# Altium schematic sheet Gyroscope.SchDoc
size A; SheetNumber: 3; SheetTotal: 6
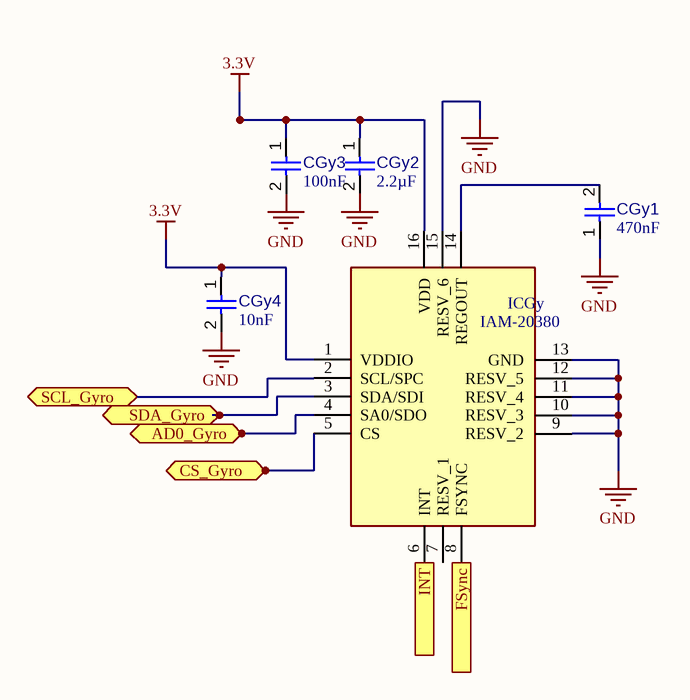
[diagram p0: Gyroscope.SchDoc]

## Parts
CGy1  value 470nF  [CAPC0402(1005)60_L]  (hidden comment: Capacitor 470nF +/-40% 10V 0402)
CGy2  value 2.2µF  [CAPC0402(1005)60_L]  (hidden comment: Capacitor 2,2µF +/-20% 10V 0402)
CGy3  value 100nF  [CAPC1005X56X25LL10T15]  (hidden comment: Capacitor 0.1 uF +/- 5% 16 V 0402)
CGy4  value 10nF  [CAPC0402(1005)60_L]  (hidden comment: Capacitor 10nF +/-20% 50V 0402)
ICGy  IAM-20380  [IAM20680HP]

## Ports
AD0_Gyro (bidir), CS_Gyro (bidir), FSync (out), INT (in), SCL_Gyro (bidir), SDA_Gyro (bidir)

## Nets
3.3V: CGy2.1 CGy3.1 CGy4.1 ICGy.1(VDDIO) ICGy.16(VDD)
GND: CGy1.1 CGy2.2 CGy3.2 CGy4.2 ICGy.9(RESV_2) ICGy.10(RESV_3) ICGy.11(RESV_4) ICGy.12(RESV_5) ICGy.13(GND) ICGy.15(RESV_6)
AD0_Gyro: ICGy.4(SA0/SDO) ; port AD0_Gyro
CS_Gyro: ICGy.5(CS) ; port CS_Gyro
FSync: ICGy.8(FSYNC) ; port FSync
INT: ICGy.6(INT) ; port INT
SCL_Gyro: ICGy.2(SCL/SPC) ; port SCL_Gyro
SDA_Gyro: ICGy.3(SDA/SDI) ; port SDA_Gyro
NetCGy1_2: CGy1.2 ICGy.14(REGOUT)

Not connected (* = marked no-connect by the designer): ICGy 7(RESV_1)

## Library data of the parts
CGy1 = CMP-001-00060-4: Chip Capacitor, 470nF +/-40%, 10V, 0402, Thickness 0.6 mm; Tolerance: 20%; Max Operating Temperature: 85°C; Case/Package: 0402; Voltage Rating: 10V; Min Operating Temperature: -55°C; Mounting Technology: SMT; Pins: 2
CGy2 = CMP-001-00056-4: Chip Capacitor, 2,2µF +/-20%, 10V, 0402, Thickness 0.6 mm; Tolerance: 10%; Mounting Technology: SMT; Max Operating Temperature: 85°C; Case/Package: 0402; Pins: 2; Min Operating Temperature: -55°C; Voltage Rating: 10V
CGy3 = CMP-001-00001-6: Chip Capacitor, 0.1 uF, +/- 5%, 16 V, 0402 (1005 Metric); Capacitor Type: Ceramic; Voltage Rating: 16V; Max Operating Temperature: 125°C; Min Operating Temperature: -55°C; Case/Package: 0402; Mounting Technology: SM; Pins: 2; Tolerance: 5%; RoHS Compliant: True
CGy4 = CMP-001-00069-3: Chip Capacitor, 10nF +/-20%, 50V, 0402, Thickness 0.6 mm; Tolerance: 5%; Max Operating Temperature: 85°C; Pins: 2; Case/Package: 0402; Voltage Rating: 50V; Min Operating Temperature: -55°C; Mounting Technology: SMT
ICGy = IAM-20380: Integrated Circuit; Manufacturer_Name: TDK; Datasheet Link: https://3cfeqx1hf82y3xcoull08ihx-wpengine.netdna-ssl.com/wp-content/uploads/2017/11/DS-000195-IAM-20380_v1.0-Typ.pdf; Height: 0.8mm; Manufacturer_Part_Number: IAM-20380; Mouser Part Number: 410-IAM-20380; Mouser Price/Stock: https://www.mouser.co.uk/ProductDetail/TDK-InvenSense/IAM-20380?qs=PzGy0jfpSMtUqQt0Uo%252BcYw%3D%3D; Arrow Part Number: IAM-20380; Arrow Price/Stock: https://www.arrow.com/en/products/iam-20380/invensense